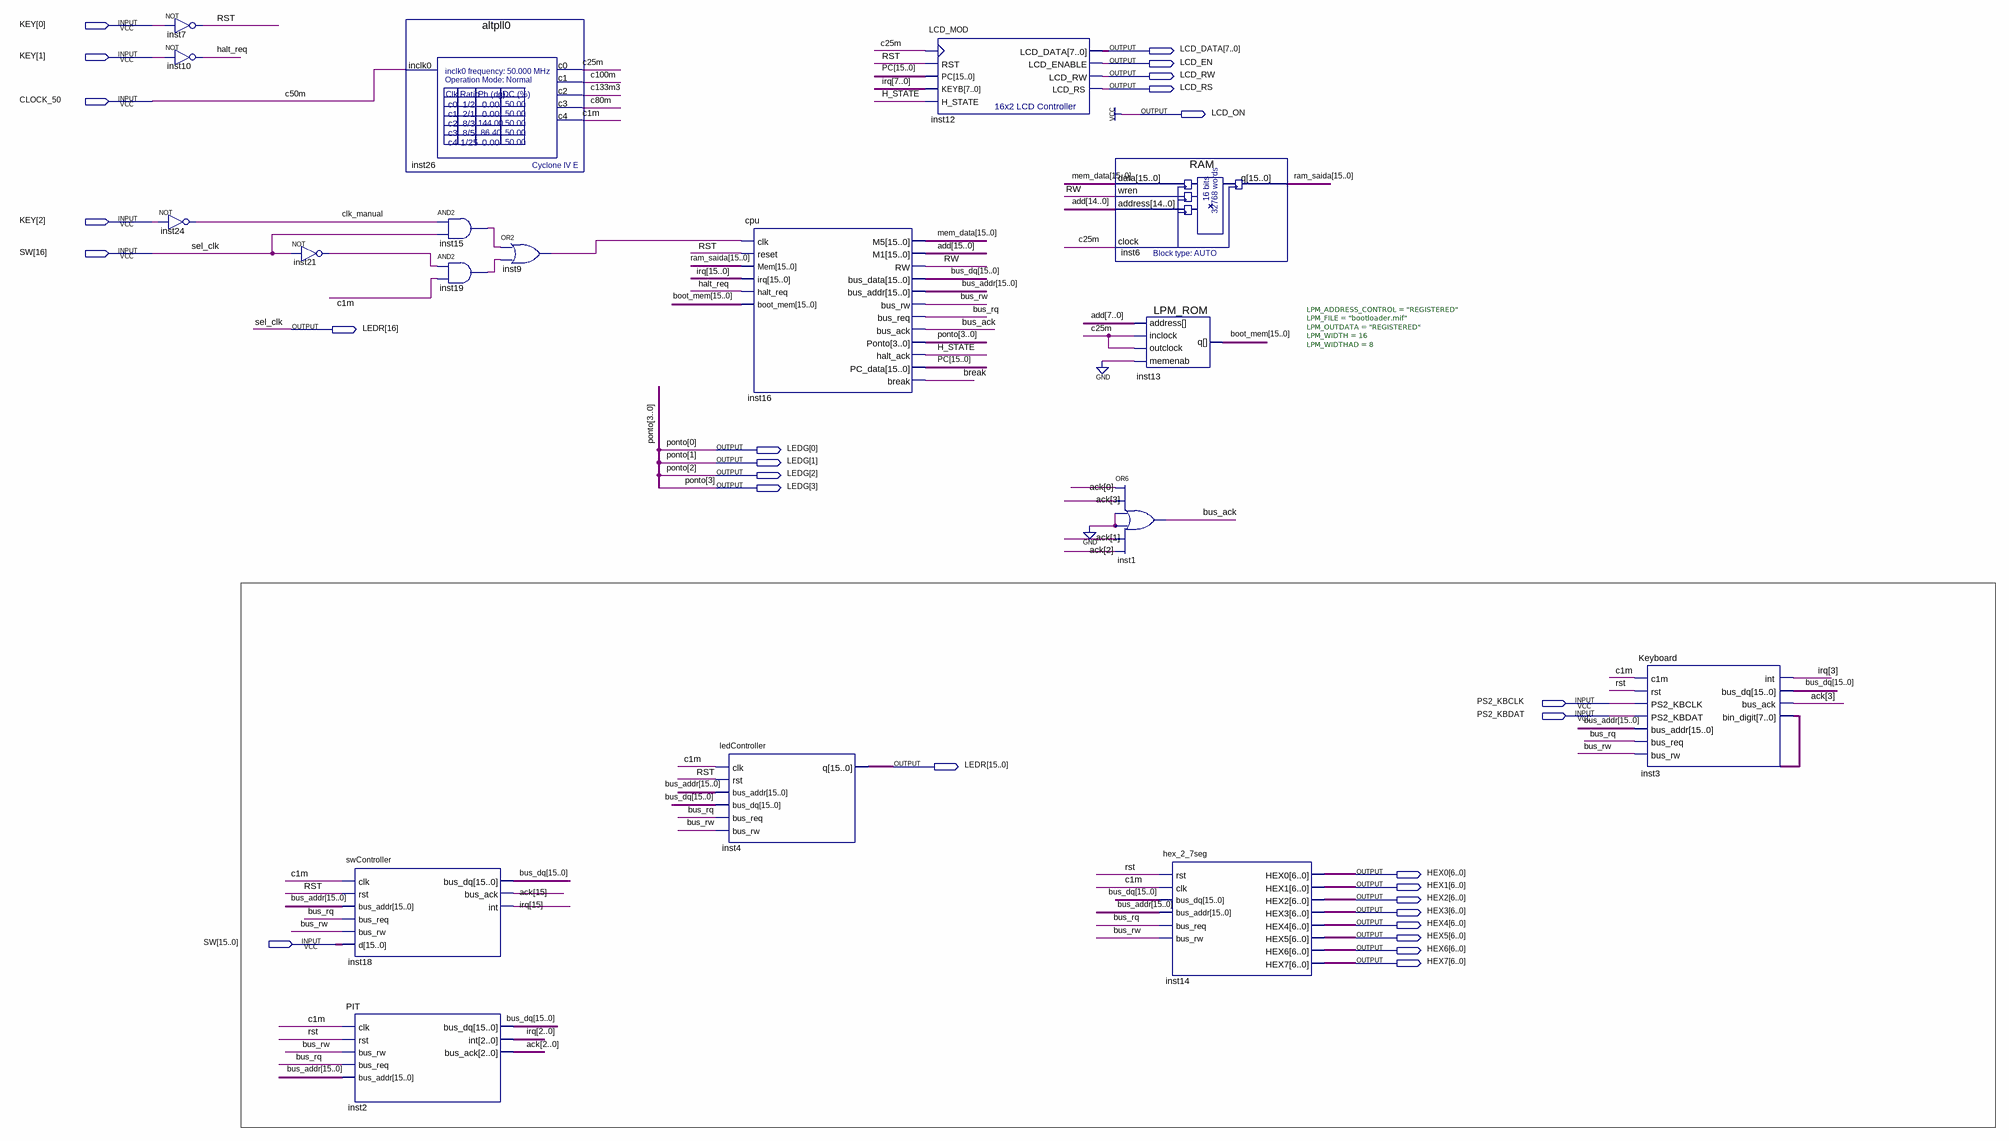
[diagram p0: schematic sheet]
// Quartus schematic AP9.bdf as structural Verilog: 18 symbols, 27 pins
module AP9 (
  input  [2:0] KEY,
  input  CLOCK_50,
  input  [16:0] SW,
  input  PS2_KBCLK,
  input  PS2_KBDAT,
  output [7:0] LCD_DATA,
  output LCD_EN,
  output LCD_RW,
  output LCD_RS,
  output LCD_ON,
  output [16:0] LEDR,
  output [3:0] LEDG,
  output [6:0] HEX0,
  output [6:0] HEX1,
  output [6:0] HEX2,
  output [6:0] HEX3,
  output [6:0] HEX4,
  output [6:0] HEX5,
  output [6:0] HEX6,
  output [6:0] HEX7
);

  wire \break , bus_ack, bus_rq, bus_rw, c1m, c25m, c80m, c100m, c133m3, clk_manual, H_STATE, halt_req,
       inst9_out, inst15_out, inst19_out, inst21_out, RST, RW;
  wire [7:0] inst3_bin_digit;
  wire [15:0] ack, add, boot_mem, bus_addr, bus_dq, irq, mem_data, PC, ram_saida;

  not inst7 (RST, KEY[0]);
  not inst10 (halt_req, KEY[1]);
  not inst24 (clk_manual, KEY[2]);
  not inst21 (inst21_out, SW[16]);
  swController inst18 (
    .clk(c1m), .rst(RST), .bus_addr(bus_addr), .bus_req(bus_rq), .bus_rw(bus_rw), .d(SW[15:0]),
    .bus_dq(bus_dq), .bus_ack(ack[15]), .\int (irq[15]));
  PIT inst2 (
    .clk(c1m), .rst(RST), .bus_rw(bus_rw), .bus_req(bus_rq), .bus_addr(bus_addr), .\int (irq[2:0]),
    .bus_ack(ack[2:0]), .bus_dq(bus_dq));
  altpll0 inst26 (.inclk0(CLOCK_50), .c0(c25m), .c1(c100m), .c2(c133m3), .c3(c80m), .c4(c1m));
  and inst15 (inst15_out, clk_manual, SW[16]);
  and inst19 (inst19_out, inst21_out, c1m);
  or inst9 (inst9_out, inst15_out, inst19_out);
  ledController inst4 (
    .clk(c1m), .rst(RST), .bus_addr(bus_addr), .bus_dq(bus_dq), .bus_req(bus_rq), .bus_rw(bus_rw),
    .q(LEDR[15:0]));
  cpu inst16 (
    .clk(inst9_out), .reset(RST), .Mem(ram_saida), .irq(irq), .halt_req(halt_req), .boot_mem(boot_mem),
    .bus_ack(bus_ack), .M5(mem_data), .M1(add), .RW(RW), .bus_addr(bus_addr), .bus_rw(bus_rw),
    .bus_req(bus_rq), .Ponto(LEDG), .halt_ack(H_STATE), .PC_data(PC), .\break (\break ), .bus_data(bus_dq));
  LCD_MOD inst12 (
    .RST(RST), .PC(PC), .KEYB(irq[7:0]), .H_STATE(H_STATE), .CLK(c25m), .LCD_DATA(LCD_DATA),
    .LCD_ENABLE(LCD_EN), .LCD_RW(LCD_RW), .LCD_RS(LCD_RS));
  RAM inst6 (.data(mem_data), .wren(RW), .address(add[14:0]), .clock(c25m), .q(ram_saida));
  LPM_ROM #(.LPM_ADDRESS_CONTROL("REGISTERED"), .LPM_FILE("bootloader.mif"), .LPM_OUTDATA("REGISTERED"), .LPM_WIDTH(16), .LPM_WIDTHAD(8)) inst13 (
    .address(add[7:0]), .inclock(c25m), .outclock(c25m), .memenab(1'b0), .q(boot_mem));
  or inst1 (bus_ack, ack[0], ack[3], 1'b0, 1'b0, ack[1], ack[2]);
  hex_2_7seg inst14 (
    .rst(RST), .clk(c1m), .bus_dq(bus_dq), .bus_addr(bus_addr), .bus_req(bus_rq), .bus_rw(bus_rw),
    .HEX0(HEX0), .HEX1(HEX1), .HEX2(HEX2), .HEX3(HEX3), .HEX4(HEX4), .HEX5(HEX5), .HEX6(HEX6), .HEX7(HEX7));
  Keyboard inst3 (
    .c1m(c1m), .rst(RST), .PS2_KBCLK(PS2_KBCLK), .PS2_KBDAT(PS2_KBDAT), .bus_addr(bus_addr),
    .bus_req(bus_rq), .bus_rw(bus_rw), .\int (irq[3]), .bus_dq(bus_dq), .bus_ack(ack[3]),
    .bin_digit(inst3_bin_digit));

  assign LCD_ON = 1'b1;
  assign LEDR[16] = SW[16];

  // Other names for the same wires on the sheet: c50m = CLOCK_50; ponto[3:0] = LEDG; sel_clk = SW[16]
endmodule
